# EAGLE design pnode (EAGLE 7.3.0)
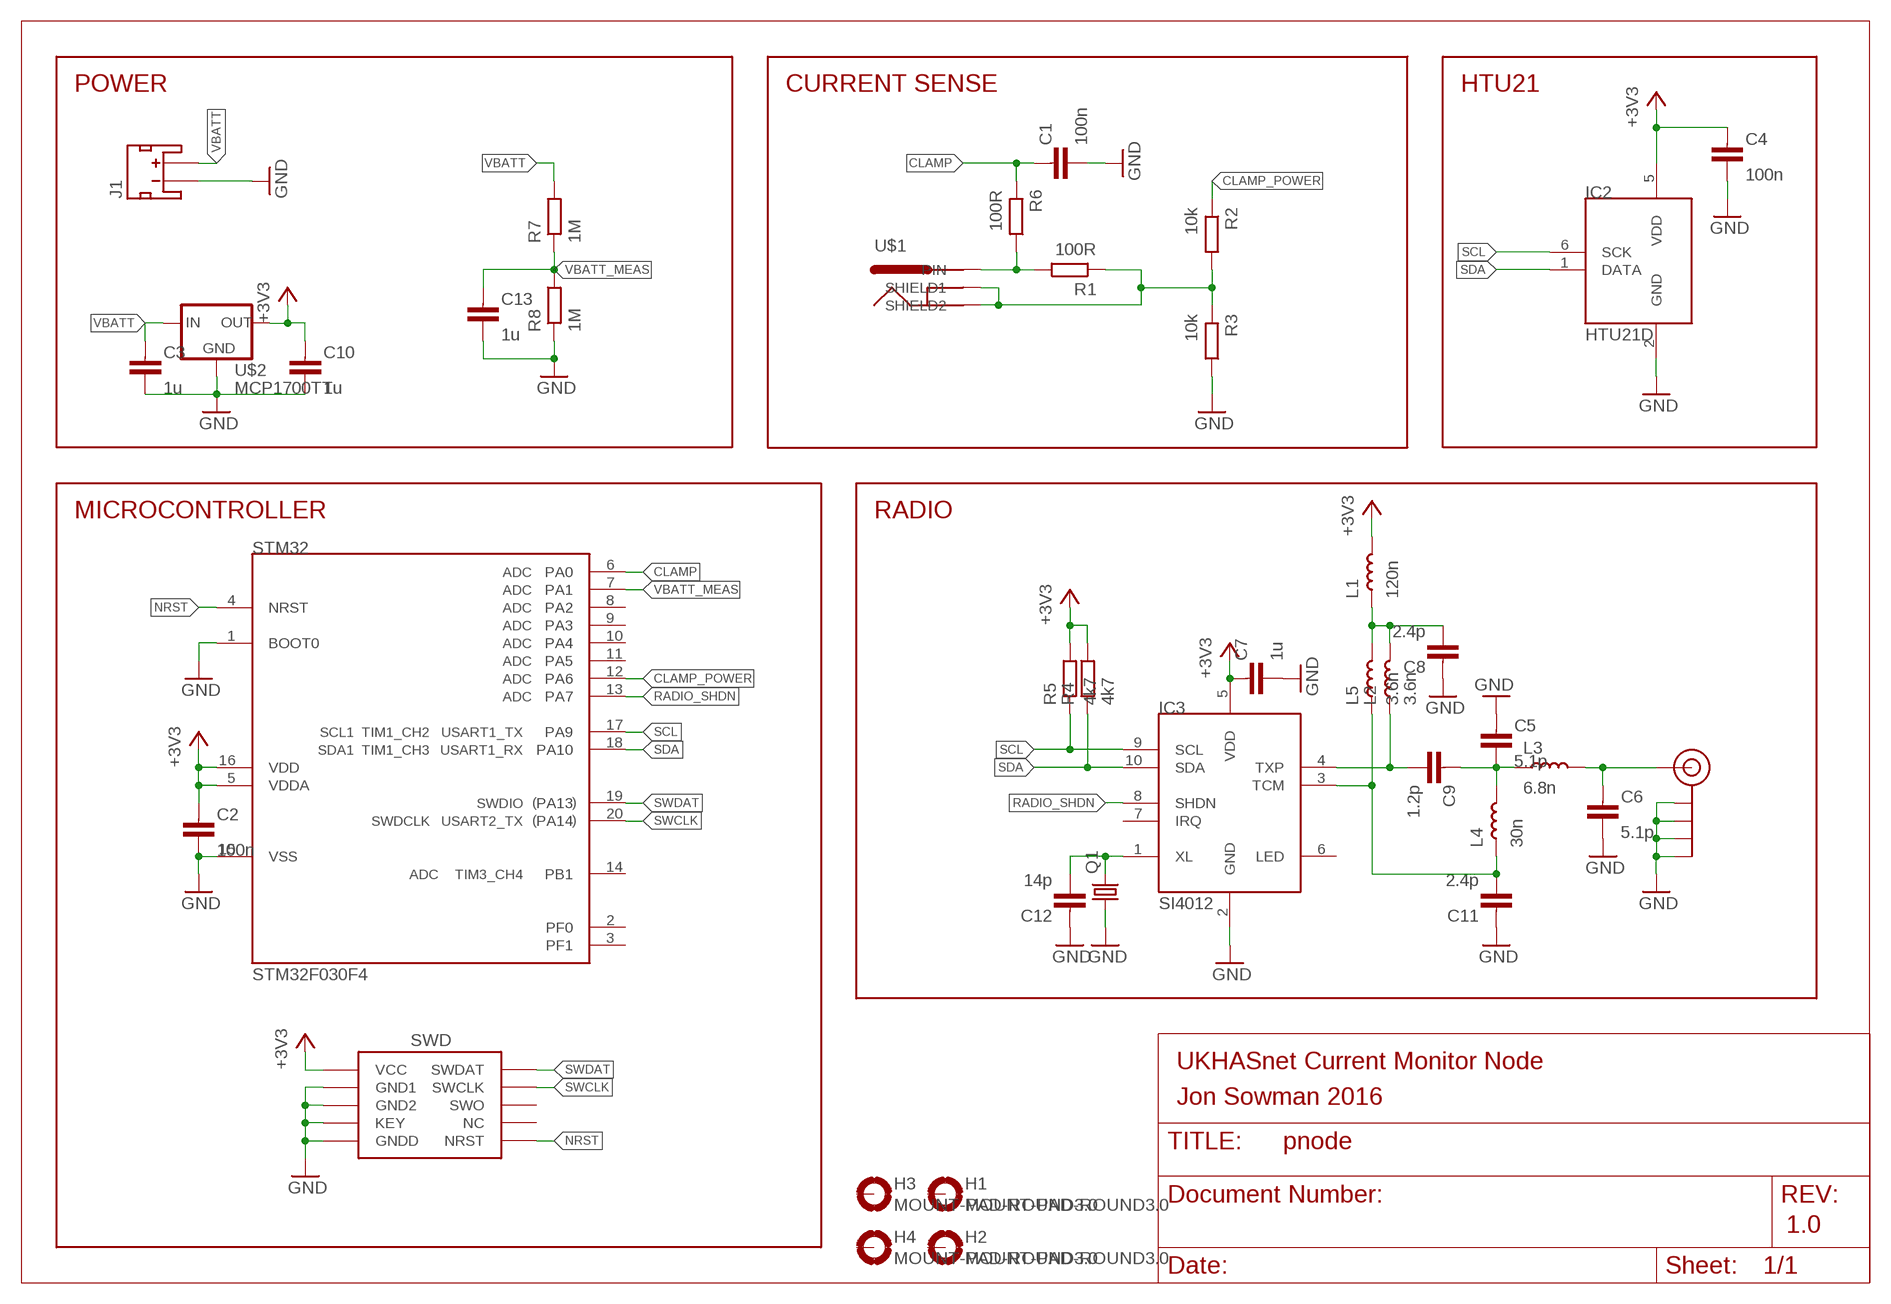
[diagram p0: schematic, sheet 1]

## Parts
C1  100n  CAPACITOR0603-N  [C0603-N]
C2  100n  CAPACITOR0603-N  [C0603-N]
C3  1u  CAPACITOR0603-N  [C0603-N]
C4  100n  CAPACITOR0603-N  [C0603-N]
C5  5.1p  CAPACITOR0603-N  [C0603-N]
C6  5.1p  CAPACITOR0603-N  [C0603-N]
C7  1u  CAPACITOR0603-N  [C0603-N]
C8  2.4p  CAPACITOR0603-N  [C0603-N]
C9  1.2p  CAPACITOR0603-N  [C0603-N]
C10  1u  CAPACITOR0603-N  [C0603-N]
C11  2.4p  CAPACITOR0603-N  [C0603-N]
C12  14p  CAPACITOR0603-N  [C0603-N]
C13  1u  CAPACITOR0603-N  [C0603-N]
H1  MOUNT-PAD-ROUND3.0  [3,0-PAD]
H2  MOUNT-PAD-ROUND3.0  [3,0-PAD]
H3  MOUNT-PAD-ROUND3.0  [3,0-PAD]
H4  MOUNT-PAD-ROUND3.0  [3,0-PAD]
IC2  HTU21D  [DFN6-L]
IC3  SI4012  [MSOP10]
J1  JST_2MM_MALE_TH  [JST-2-TH]
J$1  SMA_EDGE  [SMA-EDGE]
L1  120n  INDUCTOR0603-N  [L0603-N]
L2  3.6n  INDUCTOR0402-N  [L0402-N]
L3  6.8n  INDUCTOR0402-N  [L0402-N]
L4  30n  INDUCTOR0402-N  [L0402-N]
L5  3.6n  INDUCTOR0402-N  [L0402-N]
Q1  CRYSTALHC49S  [HC49/S]
R1  100R  RESISTOR0603-N  [R0603-N]
R2  10k  RESISTOR0603-N  [R0603-N]
R3  10k  RESISTOR0603-N  [R0603-N]
R4  4k7  RESISTOR0603-N  [R0603-N]
R5  4k7  RESISTOR0603-N  [R0603-N]
R6  100R  RESISTOR0603-N  [R0603-N]
R7  1M  RESISTOR0603-N  [R0603-N]
R8  1M  RESISTOR0603-N  [R0603-N]
STM32  STM32F030F4  [TSSOP20]
U$1  13MM_DC_JACKPTH  [13MM_DC_JACK]
U$2  MCP1700TT  [SOT23]
U$3  SWD_PTH_SHROUD  [SWD_PTH_SHROUD]

## Nets
+3V3: C2.1 C4.1 C7.1 C10.1 IC2.5(VDD) IC3.5(VDD) L1.2 R4.2 R5.2 STM32.5(VDDA) STM32.16(VDD) U$2.2(OUT) U$3.1(VCC)
CLAMP: C1.1 R6.1 STM32.6(PA0)
CLAMP_POWER: R2.1 STM32.12(PA6)
GND: C1.2 C2.2 C3.2 C4.2 C5.1 C6.2 C7.2 C8.1 C10.2 C11.1 C12.1 C13.2 IC2.2(GND) IC3.2(GND) J1.2(-) J$1.GND@0(GND) J$1.GND@1(GND) J$1.GND@2(GND) J$1.GND@3(GND) Q1.1 R3.2 R8.1 STM32.1(BOOT0) STM32.15(VSS) U$2.1(GND) U$3.3(GND1) U$3.5(GND2) U$3.7(KEY) U$3.9(GNDD)
N$1: R1.2 R6.2 U$1.1(PIN)
N$2: R1.1 R2.2 R3.1 U$1.2(SHIELD1) U$1.3(SHIELD2)
N$4: C8.2 L1.1 L2.2 L5.2
N$5: C12.2 IC3.1(XL) Q1.2
N$7: C5.2 C9.1 L3.1 L4.2
N$8: C11.2 IC3.3(TCM) L4.1 L5.1
N$9: C9.2 IC3.4(TXP) L2.1
N$10: C6.1 J$1.SIG(SIGNAL) L3.2
NRST: STM32.4(NRST) U$3.10(NRST)
RADIO_SHDN: IC3.8(SHDN) STM32.13(PA7)
SCL: IC2.6(SCK) IC3.9(SCL) R5.1 STM32.17(PA9)
SDA: IC2.1(DATA) IC3.10(SDA) R4.1 STM32.18(PA10)
SWCLK: STM32.20(PA14) U$3.4(SWCLK)
SWDAT: STM32.19(PA13) U$3.2(SWDAT)
VBATT: C3.1 J1.1(+) R7.2 U$2.3(IN)
VBATT_MEAS: C13.1 R7.1 R8.2 STM32.7(PA1)
Unconnected: H1.B3,0(MOUNT) H2.B3,0(MOUNT) H3.B3,0(MOUNT) H4.B3,0(MOUNT) IC3.6(LED) IC3.7(IRQ) STM32.2(PF0) STM32.3(PF1) STM32.8(PA2) STM32.9(PA3) STM32.10(PA4) STM32.11(PA5) STM32.14(PB1) U$3.6(SWO) U$3.8(NC)

## Notes on the sheet
- POWER | CURRENT SENSE | HTU21
- MICROCONTROLLER | RADIO
- UKHASnet Current Monitor Node
- Jon Sowman 2016
- 1.0

## Library data of the parts
C1-C13 = passives-7351:CAPACITOR
H1-H4 = dtb:MOUNT-PAD-ROUND: MOUNTING PAD, round
IC2 = Mine:HTU21D
IC3 = Mine:SI4012
J1 = dtb:JST_2MM_MALE_TH: Mates to single-cell LiPo batteries. CONN-08352
J$1 = jonsowman:SMA_EDGE: SMA Antenna Connector End launch SMA connector. The paste layer has been removed so that the connector can be hand soldered onto the board after reflow.
L1-L5 = passives-7351:INDUCTOR
Q1 = crystal:CRYSTAL: CRYSTAL; OC_FARNELL: 1667008; OC_NEWARK: unknown
R1-R8 = passives-7351:RESISTOR
STM32 = dtb:STM32F030F4
U$1 = jonsowman:13MM_DC_JACK
U$2 = dtb:MCP1700
U$3 = jonsowman:SWD_PTH_SHROUD

## Board
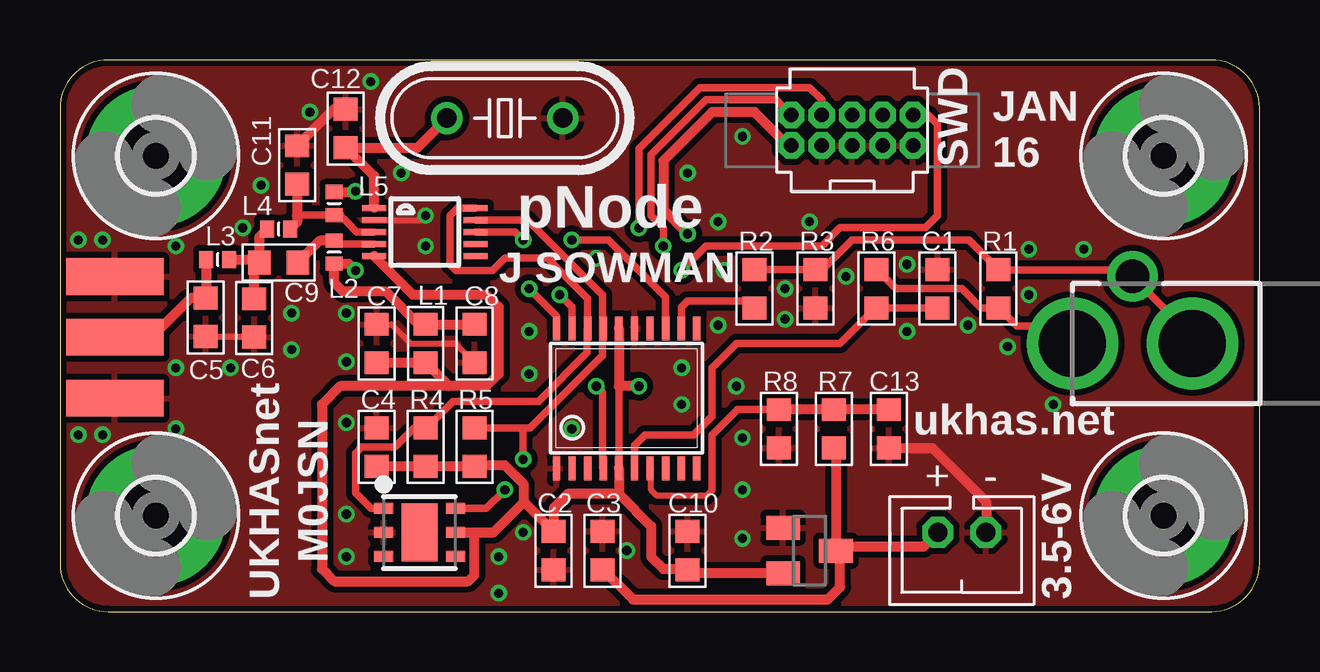
[diagram p1: board, top side]
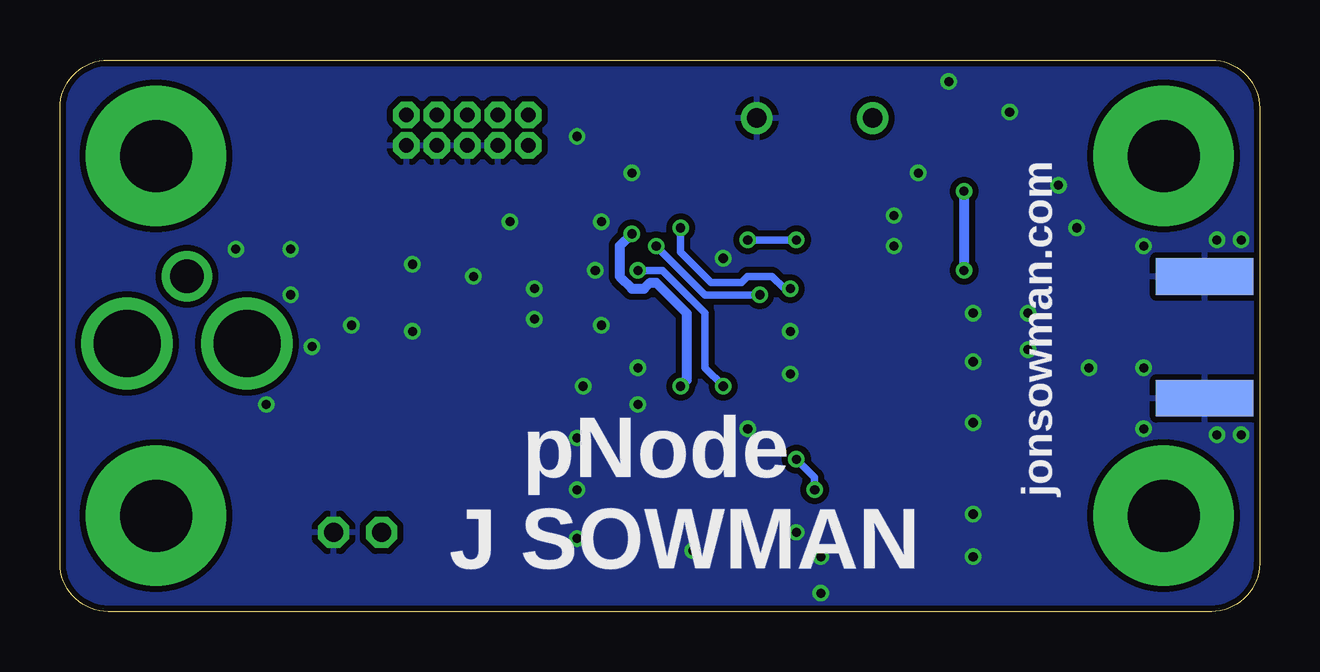
[diagram p2: board, bottom side, seen from below]

Size 50 x 23 mm. Coordinates in mm from the lower left corner, seen from the top.
Outline: 48,23 2,23 arc90 0,21 0,2 arc90 2,0 48,0 arc90 50,2 50,21 arc90 48,23
Copper layers (1*16): Top 0.035mm / dielectric 1.5mm / Bottom 0.035mm
Design rules "dirt_cheap_dirty_boards.v1": minimum track width 5mil, minimum drill 12mil, track to track 5mil, track to pad 5mil, pad to pad 5mil, via to via 5mil, smd to smd 0mil, copper to edge 10mil, drill to drill 10mil, minimum pad ring 10mil, minimum via ring 6mil, stop-mask expansion 2mil, vias tented up to drill 25mil, thermal gap 10mil

### Footprints (pad centres in the part's own frame; a part is rotated, then mirrored left to right if it is on the bottom)
C0603-N = smd 0.95 x 1: 1 -0.8,0; 2 0.8,0
3,0-PAD = drill 3 pad 5.842: B3,0 0,0
DFN6-L = smd 0.45 x 0.8: 1 -1,-1.5; 2 0,-1.5; 3 1,-1.5; 4 1,1.5; 5 0,1.5; 6 -1,1.5 | smd 2.4 x 1.5: EP 0,0
MSOP10 = smd 0.25 x 1: 1 -1,-2.113; 2 -0.5,-2.113; 3 0,-2.113; 4 0.5,-2.113; 5 1,-2.113; 6 1,2.113; 7 0.5,2.113; 8 0,2.113; 9 -0.5,2.113; 10 -1,2.113
JST-2-TH = drill 0.8 octagon: 1 1,0; 2 -1,0
SMA-EDGE = smd 1.524 x 4.064: GND@0 0,0; GND@1 5.08,0; SIG 2.54,0 | smd 1.524 x 4.064 bottom: GND@2 0,0; GND@3 5.08,0
L0603-N = smd 0.95 x 1: 1 -0.8,0; 2 0.8,0
L0402-N = smd 0.59 x 0.72: 1 -0.48,0; 2 0.48,0
HC49/S = drill 0.813: 1 -2.413,0; 2 2.413,0
R0603-N = smd 0.95 x 1: 1 -0.8,0; 2 0.8,0
TSSOP20 = smd 0.305 x 0.991: 1 -2.925,-2.918; 2 -2.275,-2.918; 3 -1.625,-2.918; 4 -0.975,-2.918; 5 -0.325,-2.918; 6 0.325,-2.918; 7 0.975,-2.918; 8 1.625,-2.918; 9 2.275,-2.918; 10 2.925,-2.918; 11 2.925,2.918; 12 2.275,2.918; 13 1.625,2.918; 14 0.975,2.918; 15 0.325,2.918; 16 -0.325,2.918; 17 -0.975,2.918; 18 -1.625,2.918; 19 -2.275,2.918; 20 -2.925,2.918
13MM_DC_JACK = drill 2.8: 1 2.5,0; 2 -2.5,0 | drill 1.4: 3 0,-2.8
SOT23 = smd 1 x 1.4: 1 -0.95,-1.1; 2 0.95,-1.1; 3 0,1.1
SWD_PTH_SHROUD = drill 0.6 octagon: 1 -2.54,-0.635; 2 -2.54,0.635; 3 -1.27,-0.635; 4 -1.27,0.635; 5 0,-0.635; 6 0,0.635; 7 1.27,-0.635; 8 1.27,0.635; 9 2.54,-0.635; 10 2.54,0.635

### Placement (x,y rotation side)
C1  36.58,13.46 90 top
C2  20.57,2.54 270 top
C3  22.61,2.54 90 top
C4  13.21,6.86 90 top
C5  8.1,12.24 90 top
C6  6.07,12.27 270 top
C7  13.21,11.18 90 top
C8  17.27,11.18 90 top
C9  9.12,14.55 0 top
C10  26.16,2.54 90 top
C11  9.88,18.62 270 top
C12  11.91,20.14 270 top
C13  34.54,7.62 270 top
H1  46,19 0 top
H2  46,4 0 top
H3  4,4 0 top
H4  4,19 0 top
IC2  14.99,3.3 270 top
IC3  15.21,15.82 270 top
J1  37.59,3.3 180 top
J$1  2.29,8.89 90 top
L1  15.24,11.18 270 top
L2  11.43,14.99 270 top
L3  6.58,14.68 180 top
L4  9.12,15.95 180 top
L5  11.43,17.02 90 top
Q1  18.54,20.57 180 top
R1  39.12,13.46 270 top
R2  28.96,13.46 90 top
R3  31.5,13.46 270 top
R4  15.24,6.86 270 top
R5  17.27,6.86 270 top
R6  34.04,13.46 90 top
R7  32.26,7.62 270 top
R8  29.97,7.62 90 top
STM32  23.62,8.89 0 top
U$1  44.7,11.18 180 top
U$2  31.24,2.54 270 top
U$3  33.02,20.07 0 top

### Tracks (layer width: path | path; a pad name or v marks a point on that pad's centre or on a via)
+3V3  (via drill 0.38)
  Top 0.254: IC3.5 12.86,14.82 | 17.31,6.1 R5.2
  Top 0.305: 23.3,9.4 STM32.5
  Top 0.406: U$2.2 26.31,1.59 C10.1 26.12,1.78 25.15,1.78 24.64,2.29 24.64,3.56 23.3,4.9 | STM32.5 23.3,4.9 | R5.2 R4.2 C4.1 | 23.3,4.9 21.15,4.9 20.57,4.32 C2.1 19.34,4.57 | C7.1 L1.2 16.22,9.4 | 16.22,9.4 17.78,9.4 18.29,9.91 18.29,12.7 17.78,13.21 14.71,13.21 IC3.5 | 19.34,4.57 19.34,5.3 18.54,6.1 17.31,6.1 | 16.22,9.4 11.68,9.4 10.92,8.64 10.92,1.78 11.43,1.27 17.02,1.27 17.27,1.52 17.27,3.3 | IC2.5 17.27,3.3 | 17.27,3.3 18.07,3.3 19.34,4.57 | STM32.16 23.3,9.4 v24.13,9.4 | v26.16,15.75 25.15,16.76 25.15,18.8 27.18,20.83 28.96,20.83 30.35,19.43 U$3.1
  Bottom 0.406: v26.16,15.75 26.67,15.24 26.67,13.97 26.16,13.46 25.65,13.46 25.4,13.72 25.15,13.72 23.88,12.45 23.88,9.65 v24.13,9.4
CLAMP
  Top 0.254: R6.1 34,12.66
  Top 0.305: C1.1 R6.1 | 34,12.66 32.51,11.18 28.19,11.18 27.18,10.16 27.18,8.13 26.42,7.37 24.38,7.37 23.95,6.93 STM32.6
CLAMP_POWER
  Top 0.254: 28.66,12.95 R2.1
  Top 0.305: STM32.12 25.9,12.69 26.16,12.95 28.66,12.95
GND  (via drill 0.38)
  Top 0.254: C5.1 6.09,11.44 C6.2 | C7.2 13.8,11.98 14.61,11.18 16.47,11.18 C8.1 | IC3.2 15.05,16.32 v15.24,16.51
  Top 0.406: C12.1 11.4,20.94 C11.1 | C13.2 36.36,6.82 38.61,4.57 38.61,3.32 J1.2
  other vias: 4.83,10.16 4.83,7.62 4.83,15.24 0.76,15.49 0.76,7.37 1.78,7.37 1.78,15.49 11.94,7.87 11.94,2.29 11.94,4.06 25.91,10.16 25.91,8.64 19.56,11.68 19.56,9.91 15.24,15.24 9.65,12.45 11.94,12.45 10.41,20.83 8.38,17.78 7.62,16 28.45,7.24 28.45,5.08 28.45,3.05 28.19,9.4 37.85,11.94 35.31,11.68 27.43,16.26 31.24,16.26 28.45,19.81 26.16,18.29 9.65,10.92 7.11,10.16 18.29,2.29 19.3,3.3 18.29,0.76 14.22,18.29 12.95,22.1 39.5,11.05 41.4,8.64 40.39,15.11 42.67,15.11 40.39,13.21 35.31,14.48 21.34,7.62 11.94,10.41 23.62,2.54 27.69,14.22 30.23,13.46 32.77,13.97 30.23,12.19 27.43,11.94 22.35,14.73
  pour Top (isolate 0.254): -0.25,23.37 50.04,23.37 50.04,0 -0.25,0
  pour Bottom (isolate 0.254): 0,22.86 50.29,22.86 50.29,-0.25 0,-0.25
N$1
  Top 0.305: 41.48,11.9 39.88,11.9 R1.2 38.39,12.66 37.59,13.46 34.84,13.46 R6.2
  Top 0.406: 41.48,11.9 U$1.1
N$2
  Top 0.254: 39.15,14.23 R1.1 | R3.1 31.79,14.26
  Top 0.305: R2.2 R3.1 | 31.79,14.26 33.02,15.49 37.88,15.49 R1.1 | 39.15,14.23 44.45,14.23 U$1.3 47.2,11.48 U$1.2
N$4  (via drill 0.38)
  Top 0.406: C8.2 L1.1 14.95,11.98 13.59,13.34 11.81,13.34 11.43,13.72 L2.2 12.04,14.51 v12.32,14.22 | L5.2 12.29,17.5 v12.32,17.53
  Bottom 0.406: v12.32,17.53 v12.32,14.22
N$5
  Top 0.406: IC3.1 13.1,18.16 C12.2 14.9,19.34 Q1.2
N$7
  Top 0.406: L3.1 8.19,14.68 C9.1 | C9.1 8.32,15.63 L4.2 | C5.2 8.1,14.34 C9.1
N$8
  Top 0.305: IC3.3 12.37,15.82 11.94,16.26 11.66,16.54 | L5.1 9.91,16.54 9.88,16.51
  Top 0.406: C11.2 9.88,16.51 9.88,16.23 L4.1 | L5.1 11.66,16.54
N$9
  Top 0.254: 11.57,15.32 L2.1
  Top 0.305: IC3.4 11.57,15.32
  Top 0.406: L2.1 10.83,15.47 C9.2
N$10
  Top 0.406: J$1.SIG 3.81,11.43 5.45,13.07 C6.1 6.1,13.1 L3.2
NRST  (via drill 0.38)
  Top 0.254: 22.61,6.01 STM32.4
  Top 0.305: U$3.10 36.2,20.7 36.58,20.32 36.58,16.51 36.07,16 32.51,16 31.75,15.24 26.92,15.24 v25.91,14.22 | v22.35,9.4 22.61,9.14 22.61,6.01
  Bottom 0.305: v25.91,14.22 24.89,14.22 23.11,12.45 23.11,10.16 v22.35,9.4
RADIO_SHDN  (via drill 0.38)
  Top 0.305: IC3.8 18.97,15.82 v19.3,15.49 | v21.34,15.49 22.86,15.49 25.25,13.11 STM32.13
  Bottom 0.305: v19.3,15.49 v21.34,15.49
SCL  (via drill 0.38)
  Top 0.254: 22.61,11.77 STM32.17 22.61,11.85
  Top 0.305: R5.1 19.3,7.66 | 19.3,7.66 19.6,7.66 22.61,10.67 22.61,11.77 | IC3.9 19.49,16.32 22.61,13.21 22.61,11.85 | IC2.6 17.76,4.3 v18.54,5.08 | v19.3,6.35 19.3,7.66
  Bottom 0.305: v18.54,5.08 18.54,5.59 v19.3,6.35
SDA
  Top 0.254: 21.97,11.78 STM32.18
  Top 0.305: 21.97,11.78 21.97,10.79 19.94,8.76 16.38,8.76 15.28,7.66 R4.1 14.77,7.66 13.97,6.86 12.57,6.86 12.32,6.6 12.32,4.95 12.95,4.32 12.97,4.3 IC2.1 | IC3.10 16.57,16.82 16.26,16.51 16.26,14.48 16.51,14.22 18.03,14.22 18.54,14.73 20.32,14.73 20.83,14.22 22,13.05 STM32.18
SWCLK  (via drill 0.38)
  Top 0.305: STM32.20 20.7,12.32 v19.56,13.46 | v24.13,16 24.13,19.3 26.67,21.84 31.24,21.84 31.75,21.34 U$3.4
  Bottom 0.254: v19.56,13.46 19.81,13.46
  Bottom 0.305: 19.81,13.46 20.32,13.97 21.34,13.97 21.59,13.72 22.86,13.72 24.13,14.99 v24.13,16
SWDAT  (via drill 0.38)
  Top 0.305: STM32.19 21.35,12.69 v20.83,13.21 | v25.15,15.24 25.15,16 24.64,16.51 24.64,19.05 26.92,21.34 29.84,21.34 U$3.2
  Bottom 0.305: v20.83,13.21 23.11,13.21 v25.15,15.24
VBATT
  Top 0.406: 32.51,2.71 U$2.3 | 32.51,2.71 33.02,2.71 36,2.71 J1.1 | U$2.3 32.51,2.37 32.51,1.02 32,0.51 23.88,0.51 22.64,1.74 C3.1 | 32.51,2.71 U$2.3 | R7.2 32.34,6.82 U$2.3
VBATT_MEAS
  Top 0.254: 27.18,5.08 26.92,4.83 24.89,4.83 24.64,5.08 24.64,5.93 STM32.7
  Top 0.305: R8.2 28.23,8.42 27.18,7.37 27.18,5.08
  Top 0.406: C13.1 R7.1 R8.2

### Text on the board
tPlace: SWD | JAN / 16 | pNode | J SOWMAN | ukhas.net | M0JSN | UKHASnet | 3.5-6V
bPlace: jonsowman.com | pNode | J SOWMAN